# EAGLE schematic communication (EAGLE 6.1)
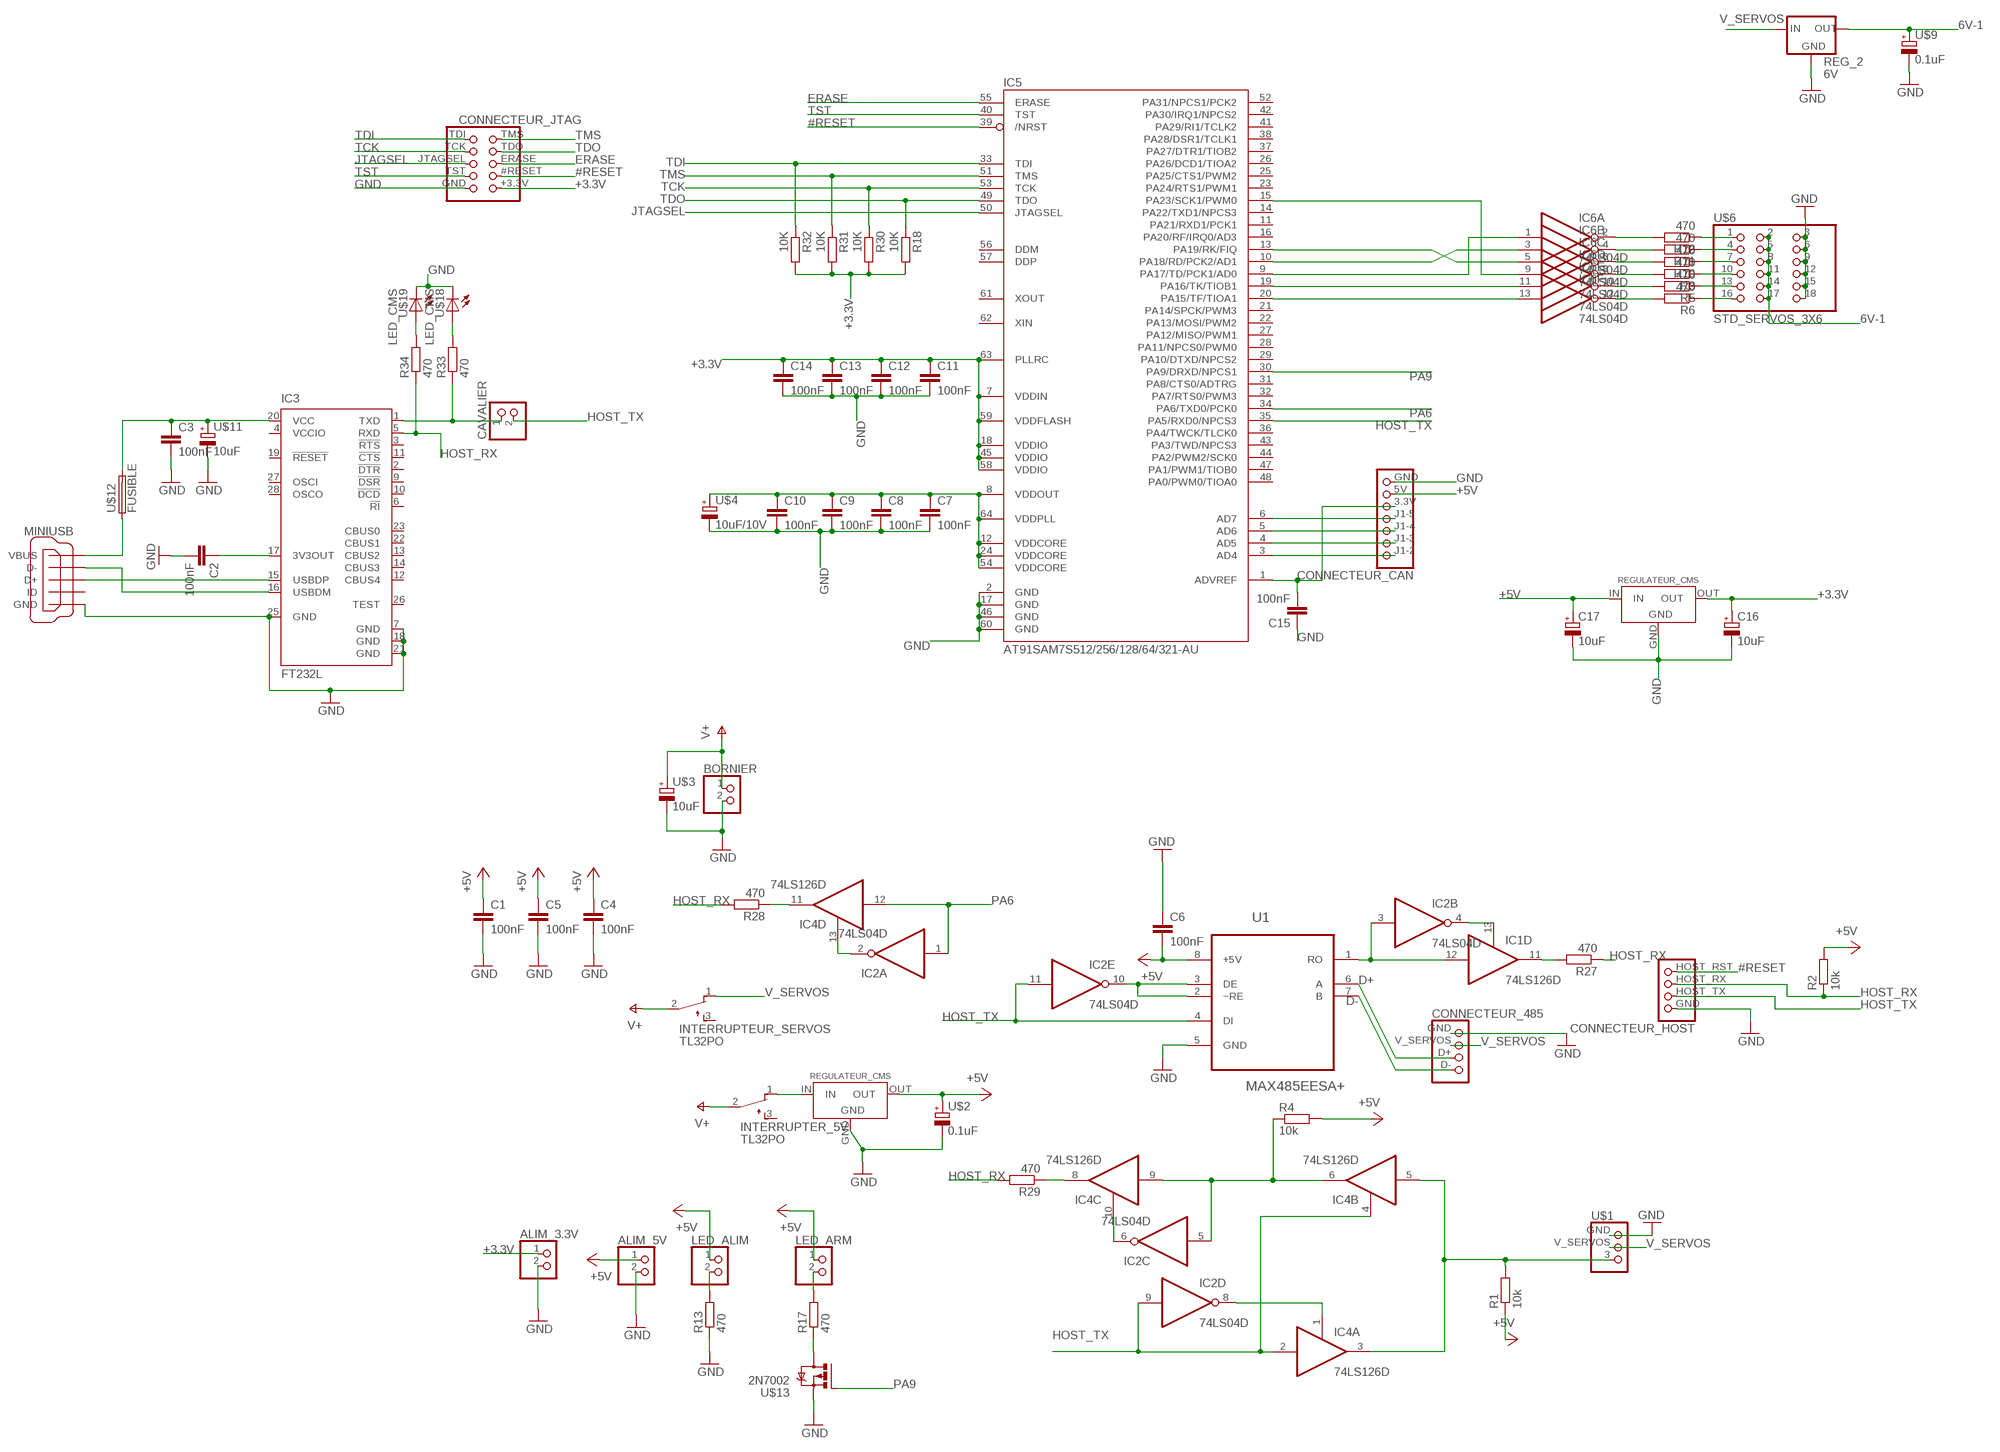
[diagram p0: schematic, sheet 1, part 1 of 2]
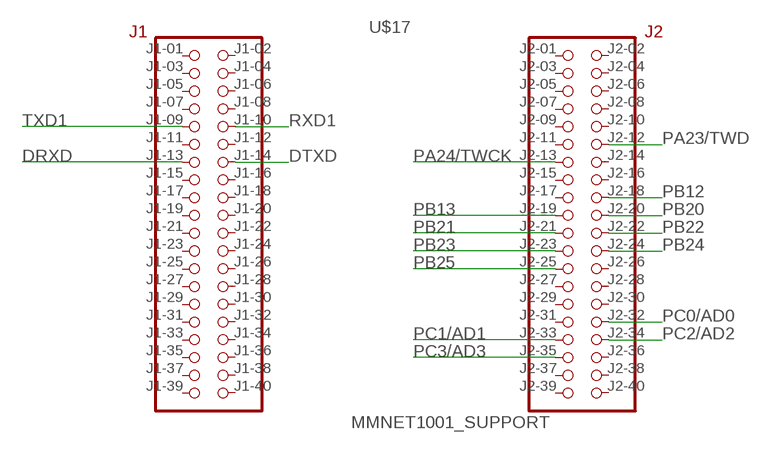
[diagram p1: schematic, sheet 1, part 2 of 2]

## Parts
ALIM_3.3V  CONNEC_1X02  [CONNEC_1X02]
ALIM_5V  CONNEC_1X02  [CONNEC_1X02]
BORNIER  CONNEC_1X02  [CONNEC_1X02]
C1  100nF  C_EU_1210  [C1210]
C2  100nF  C_EU_1210  [C1210]
C3  100nF  C_EU_1210  [C1210]
C4  100nF  C_EU_1210  [C1210]
C5  100nF  C_EU_1210  [C1210]
C6  100nF  C_EU_1210  [C1210]
C7  100nF  C_EU_1210  [C1210]
C8  100nF  C_EU_1210  [C1210]
C9  100nF  C_EU_1210  [C1210]
C10  100nF  C_EU_1210  [C1210]
C11  100nF  C_EU_1210  [C1210]
C12  100nF  C_EU_1210  [C1210]
C13  100nF  C_EU_1210  [C1210]
C14  100nF  C_EU_1210  [C1210]
C15  100nF  C_EU_1210  [C1210]
C16  10uF  CPOL-EUB  [PANASONIC_B]
C17  10uF  CPOL-EUB  [PANASONIC_B]
CAVALIER  CONNEC_1X02  [CONNEC_1X02]
CONNECTEUR_485  CONNECTEUR_485  [CONNECTEUR_485]
CONNECTEUR_CAN  CONNECTEUR_CAN  [CONNECTEUR_CAN]
CONNECTEUR_HOST  CONNECTEUR_HOST  [CONNECTEUR_HOST]
CONNECTEUR_JTAG  CONNECTEUR_JTAG  [CONNEC_JTAG]
IC1  74LS126D  [SO14]
IC2  74LS04D  [SO14]
IC3  FT232L  [SSOP28]
IC4  74LS126D  [SO14]
IC5  AT91SAM7S512/256/128/64/321-AU  [LQFP64]
IC6  74LS04D  [SO14]
INTERRUPTER_5V  TL32PO  [TL3XPO]
INTERRUPTEUR_SERVOS  TL32PO  [TL3XPO]
LED_ALIM  CONNEC_1X02  [CONNEC_1X02]
LED_ARM  CONNEC_1X02  [CONNEC_1X02]
MINIUSB  MINIUSB  [MINI_USB]
R1  10k  R-EU_R0805  [R0805]
R2  10k  R-EU_R0805  [R0805]
R3  470  R-EU_R0805  [R0805]
R4  10k  R-EU_R0805  [R0805]
R5  470  R-EU_R0805  [R0805]
R6  470  R-EU_R0805  [R0805]
R10  470  R-EU_R0805  [R0805]
R11  470  R-EU_R0805  [R0805]
R12  470  R-EU_R0805  [R0805]
R13  470  R-EU_R0805  [R0805]
R17  470  R-EU_R0805  [R0805]
R18  10K  R-EU_R0805  [R0805]
R27  470  R-EU_R0805  [R0805]
R28  470  R-EU_R0805  [R0805]
R29  470  R-EU_R0805  [R0805]
R30  10K  R-EU_R0805  [R0805]
R31  10K  R-EU_R0805  [R0805]
R32  10K  R-EU_R0805  [R0805]
R33  470  R-EU_R0805  [R0805]
R34  470  R-EU_R0805  [R0805]
REG_2  6V  78XXL  [78XXL]
U1  MAX485EESA+  [SOIC127P600X175-8N]
U$1  CONNECTEUR_TTL  [CONNECTEUR_TTL]
U$2  0.1uF  CPOL-EUB  [PANASONIC_B]
U$3  10uF  CPOL-EUB  [PANASONIC_B]
U$4  10uF/10V  CPOL-EUB  [PANASONIC_B]
U$6  STD_SERVOS_3X6  [STD_SERVOS_3X6]
U$9  0.1uF  CPOL-EUB  [PANASONIC_B]
U$11  10uF  CPOL-EUB  [PANASONIC_B]
U$12  FUSIBLE  [FUSIBLE]
U$13  2N7002  [SOT23]
U$14  REGULATEUR_CMS  [REGULATEUR_CMS]
U$15  REGULATEUR_CMS  [REGULATEUR_CMS]
U$17  MMNET1001_SUPPORT  [MMNET01_SUPPORT]
U$18  LED_CMS  [LED_CMS]
U$19  LED_CMS  [LED_CMS]

## Nets
6V-1: REG_2.OUT U$6.2 U$6.5 U$6.8 U$6.11 U$6.14 U$6.17 U$9.+
#RESET: CONNECTEUR_HOST.HOST_RST CONNECTEUR_JTAG.#RESET IC5.39(/NRST)
+3.3V: ALIM_3.3V.1 C11.1 C12.1 C13.1 C14.1 C15.2 C16.+ CONNECTEUR_CAN.3.3V CONNECTEUR_JTAG.+3.3V IC5.1(ADVREF) IC5.7(VDDIN) IC5.18(VDDIO) IC5.45(VDDIO) IC5.58(VDDIO) IC5.59(VDDFLASH) IC5.63(PLLRC) R18.2 R30.2 R31.2 R32.2 U$15.OUT
+5V: ALIM_5V.1 C1.1 C4.1 C5.1 C6.2 C17.+ CONNECTEUR_CAN.5V LED_ALIM.1 LED_ARM.1 R1.1 R2.2 R4.2 U1.8(+5V) U$2.+ U$14.OUT U$15.IN
ALIM_USB: C3.1 IC3.20(VCC) U$11.+ U$12.P$2
D+: CONNECTEUR_485.D+ U1.6(A)
D-: CONNECTEUR_485.D- U1.7(B)
DRXD: U$17.J1-13
DTXD: U$17.J1-14
ERASE: CONNECTEUR_JTAG.ERASE IC5.55(ERASE)
GND: ALIM_3.3V.2 ALIM_5V.2 BORNIER.2 C1.2 C2.2 C3.2 C4.2 C5.2 C6.1 C7.2 C8.2 C9.2 C10.2 C11.2 C12.2 C13.2 C14.2 C15.1 C16.- C17.- CONNECTEUR_485.GND CONNECTEUR_CAN.GND CONNECTEUR_HOST.GND CONNECTEUR_JTAG.GND IC3.7(GND) IC3.18(GND) IC3.21(GND) IC3.25(GND) IC5.2(GND) IC5.17(GND) IC5.46(GND) IC5.60(GND) MINIUSB.GND R13.1 REG_2.GND U1.5(GND) U$1.GND U$2.- U$3.- U$4.- U$6.3 U$6.6 U$6.9 U$6.12 U$6.15 U$6.18 U$9.- U$11.- U$13.2(S) U$14.GND U$15.GND U$18.1(C) U$19.1(C)
HOST_RX: CONNECTEUR_HOST.HOST_RX IC3.5(RXD) R2.1 R27.1 R28.2 R29.2 R34.1
HOST_TX: CAVALIER.2 CONNECTEUR_HOST.HOST_TX IC2.9(D:I) IC2.11(E:I) IC4.2(A:I) IC4.4(B:OE) IC5.35(PA5/RXD0/NPCS3) U1.4(DI)
J1-2: CONNECTEUR_CAN.J1-2 IC5.3(AD4)
J1-3: CONNECTEUR_CAN.J1-3 IC5.4(AD5)
J1-4: CONNECTEUR_CAN.J1-4 IC5.5(AD6)
J1-5: CONNECTEUR_CAN.J1-5 IC5.6(AD7)
JTAGSEL: CONNECTEUR_JTAG.JTAGSEL IC5.50(JTAGSEL)
N$1: IC2.6(C:O) IC4.10(C:OE)
N$2: IC2.5(C:I) IC4.6(B:O) IC4.9(C:I) R4.1
N$3: INTERRUPTER_5V.1(O) U$14.IN
N$4: IC2.8(D:O) IC4.1(A:OE)
N$5: IC4.3(A:O) IC4.5(B:I) R1.2 U$1.3
N$6: LED_ALIM.2 R13.2
N$7: IC1.12(D:I) IC2.3(B:I) U1.1(RO)
N$8: IC2.10(E:O) U1.2(~RE) U1.3(DE)
N$9: R17.1 U$13.3(D)
N$10: LED_ARM.2 R17.2
N$11: CAVALIER.1 IC3.1(TXD) R33.1
N$12: IC1.13(D:OE) IC2.4(B:O)
N$13: R33.2 U$18.2(A)
N$14: MINIUSB.VBUS U$12.P$1
N$15: IC2.2(A:O) IC4.13(D:OE)
N$16: R12.1 U$6.1
N$17: R11.1 U$6.4
N$18: R10.1 U$6.7
N$19: R3.1 U$6.10
N$20: R5.1 U$6.13
N$21: R6.1 U$6.16
N$22: IC6.2(A:O) R12.2
N$23: IC6.4(B:O) R11.2
N$24: IC6.6(C:O) R10.2
N$25: IC6.8(D:O) R3.2
N$26: IC6.10(E:O) R5.2
N$27: IC6.12(F:O) R6.2
N$28: R34.2 U$19.2(A)
N$43: C7.1 C8.1 C9.1 C10.1 IC5.8(VDDOUT) IC5.12(VDDCORE) IC5.24(VDDCORE) IC5.54(VDDCORE) IC5.64(VDDPLL) U$4.+
N$44: C2.1 IC3.17(3V3OUT)
N$45: IC3.15(USBDP) MINIUSB.D+
N$46: IC3.16(USBDM) MINIUSB.D-
N$64: IC5.20(PA15/TF/TIOA1) IC6.13(F:I)
N$65: IC5.19(PA16/TK/TIOB1) IC6.11(E:I)
N$66: IC5.15(PA23/SCK1/PWM0) IC6.9(D:I)
N$67: IC5.13(PA19/RK/FIQ) IC6.5(C:I)
N$68: IC5.10(PA18/RD/PCK2/AD1) IC6.3(B:I)
N$69: IC5.9(PA17/TD/PCK1/AD0) IC6.1(A:I)
PA6: IC2.1(A:I) IC4.12(D:I) IC5.34(PA6/TXD0/PCK0)
PA9: IC5.30(PA9/DRXD/NPCS1) U$13.1(G)
PA23/TWD: U$17.J2-12
PA24/TWCK: U$17.J2-13
PB12: U$17.J2-18
PB13: U$17.J2-19
PB20: U$17.J2-20
PB21: U$17.J2-21
PB22: U$17.J2-22
PB23: U$17.J2-23
PB24: U$17.J2-24
PB25: U$17.J2-25
PC0/AD0: U$17.J2-32
PC1/AD1: U$17.J2-33
PC2/AD2: U$17.J2-34
PC3/AD3: U$17.J2-35
RXD1: U$17.J1-10
TCK: CONNECTEUR_JTAG.TCK IC5.53(TCK) R30.1
TDI: CONNECTEUR_JTAG.TDI IC5.33(TDI) R32.1
TDO: CONNECTEUR_JTAG.TDO IC5.49(TDO) R18.1
TMS: CONNECTEUR_JTAG.TMS IC5.51(TMS) R31.1
TO_RX-1: IC1.11(D:O) R27.2
TO_RX-2: IC4.8(C:O) R29.1
TO_RX-3: IC4.11(D:O) R28.1
TST: CONNECTEUR_JTAG.TST IC5.40(TST)
TXD1: U$17.J1-09
V+: BORNIER.1 INTERRUPTER_5V.2(P) INTERRUPTEUR_SERVOS.2(P) U$3.+
V_SERVOS: CONNECTEUR_485.V_SERVOS INTERRUPTEUR_SERVOS.1(O) REG_2.IN U$1.V_SERVOS
Unconnected: IC1.1(A:OE) IC1.2(A:I) IC1.3(A:O) IC1.4(B:OE) IC1.5(B:I) IC1.6(B:O) IC1.8(C:O) IC1.9(C:I) IC1.10(C:OE) IC2.12(F:O) IC2.13(F:I) IC3.2(!DTR) IC3.3(!RTS) IC3.6(!RI) IC3.9(!DSR) IC3.10(!DCD) IC3.11(!CTS) IC3.12(CBUS4) IC3.13(CBUS2) IC3.14(CBUS3) IC3.19(!RESET) IC3.22(CBUS1) IC3.23(CBUS0) IC3.26(TEST) IC3.27(OSCI) IC3.28(OSCO) IC5.11(PA21/RXD1/PCK1) IC5.14(PA22/TXD1/NPCS3) IC5.16(PA20/RF/IRQ0/AD3) IC5.21(PA14/SPCK/PWM3) IC5.22(PA13/MOSI/PWM2) IC5.23(PA24/RTS1/PWM1) IC5.25(PA25/CTS1/PWM2) IC5.26(PA26/DCD1/TIOA2) IC5.27(PA12/MISO/PWM1) IC5.28(PA11/NPCS0/PWM0) IC5.29(PA10/DTXD/NPCS2) IC5.31(PA8/CTS0/ADTRG) IC5.32(PA7/RTS0/PWM3) IC5.36(PA4/TWCK/TLCK0) IC5.37(PA27/DTR1/TIOB2) IC5.38(PA28/DSR1/TCLK1) IC5.41(PA29/RI1/TCLK2) IC5.42(PA30/IRQ1/NPCS2) IC5.43(PA3/TWD/NPCS3) IC5.44(PA2/PWM2/SCK0) IC5.47(PA1/PWM1/TIOB0) IC5.48(PA0/PWM0/TIOA0) IC5.52(PA31/NPCS1/PCK2) IC5.56(DDM) IC5.57(DDP) IC5.61(XOUT) IC5.62(XIN) INTERRUPTER_5V.3(S) INTERRUPTEUR_SERVOS.3(S) MINIUSB.ID U$17.J1-01 U$17.J1-02 U$17.J1-03 U$17.J1-04 U$17.J1-05 U$17.J1-06 U$17.J1-07 U$17.J1-08 U$17.J1-11 U$17.J1-12 U$17.J1-15 U$17.J1-16 U$17.J1-17 U$17.J1-18 U$17.J1-19 U$17.J1-20 U$17.J1-21 U$17.J1-22 U$17.J1-23 U$17.J1-24 U$17.J1-25 U$17.J1-26 U$17.J1-27 U$17.J1-28 U$17.J1-29 U$17.J1-30 U$17.J1-31 U$17.J1-32 U$17.J1-33 U$17.J1-34 U$17.J1-35 U$17.J1-36 U$17.J1-37 U$17.J1-38 U$17.J1-39 U$17.J1-40 U$17.J2-01 U$17.J2-02 U$17.J2-03 U$17.J2-04 U$17.J2-05 U$17.J2-06 U$17.J2-07 U$17.J2-08 U$17.J2-09 U$17.J2-10 U$17.J2-11 U$17.J2-14 U$17.J2-15 U$17.J2-16 U$17.J2-17 U$17.J2-26 U$17.J2-27 U$17.J2-28 U$17.J2-29 U$17.J2-30 U$17.J2-31 U$17.J2-36 U$17.J2-37 U$17.J2-38 U$17.J2-39 U$17.J2-40

## Power pins joined to a net without a drawn wire
+5V: IC1.14(P:+5V) IC2.14(P:+5V) IC4.14(P:+5V) IC6.14(P:+5V)
GND: IC1.7(P:GND) IC2.7(P:GND) IC4.7(P:GND) IC6.7(P:GND) U$14.GND2(GND) U$15.GND2(GND)
VCCIO: IC3.4(VCCIO)

## Library data of the parts
ALIM_3.3V ALIM_5V BORNIER CAVALIER LED_ALIM LED_ARM = rhoban:CONNEC_1X02
C1-C15 = rhoban:C_EU_1210
C16 C17 U$2-U$4 U$9 U$11 = rcl:CPOL-EU: POLARIZED CAPACITOR, European symbol
CONNECTEUR_485 = rhoban:CONNECTEUR_485
CONNECTEUR_CAN = rhoban:CONNECTEUR_CAN
CONNECTEUR_HOST = rhoban:CONNECTEUR_HOST
CONNECTEUR_JTAG = rhoban:CONNECTEUR_JTAG
IC1 IC4 = rhoban:74*126: Quad bus BUFFER, 3-state
IC2 = rhoban:74*04: Hex INVERTER
IC3 = rhoban:FT232: Source: http://www.ftdichip.com/Documents/DataSheets/DS_FT232R_v104.pdf; MPN: FT232RL; OC_FARNELL: 1146032; OC_NEWARK: 91K9918
IC5 = at91sam7sxxx-au:AT91SAM7S512/256/128/64/321
IC6 = rhoban:74LS04D: Hex INVERTER
INTERRUPTER_5V INTERRUPTEUR_SERVOS = rhoban:TL32PO
MINIUSB = rhoban:MINIUSB
R1-R6 R10-R13 R17 R18 R27-R34 = rhoban:R-EU_: RESISTOR, European symbol
REG_2 = rhoban:78XXL: Régulateur de tension
U1 = rhoban:MAX485EESA+; DESCRIPTION: ±15kV ESD-Protected, Slew-Rate-Limited, Low-Power, RS-485/RS-422 Transceivers; MPN: MAX485EESA+; OC_FARNELL: 1379973; OC_NEWARK: 68K4798; PACKAGE: SOIC-8; SUPPLIER: Maxim
U$1 = rhoban:CONNECTEUR_TTL
U$6 = rhoban:STD_SERVOS_3X6
U$12 = rhoban:FUSIBLE
U$13 = rhoban:2N7002
U$14 U$15 = rhoban:REGULATEUR_CMS
U$17 = rhoban:MMNET1001_SUPPORT
U$18 U$19 = rhoban:LED_CMS: http://fr.farnell.com/dialight/5988110107f/led-0805-rouge/dp/1465992RL